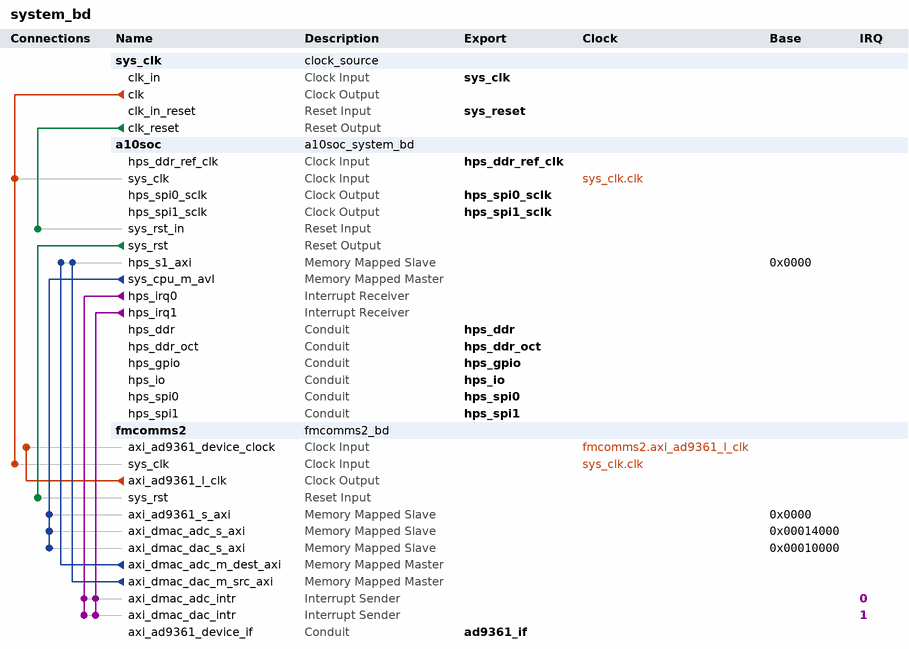
[diagram p0: system contents]
# Platform Designer (Qsys) system system_bd, Arria 10 10AS066N3F40E2SGE2
# Parameters at their usual value, and those the tool derives, are not listed.
package require -exact qsys 15.1
create_system system_bd
set_project_property DEVICE_FAMILY {Arria 10}
set_project_property DEVICE 10AS066N3F40E2SGE2

add_instance sys_clk clock_source 15.1
set_instance_parameter_value sys_clk clockFrequency 100000000

add_instance a10soc a10soc_system_bd 1.0

add_instance fmcomms2 fmcomms2_bd 1.0

# connections
add_connection fmcomms2.axi_ad9361_l_clk fmcomms2.axi_ad9361_device_clock clock
add_connection sys_clk.clk a10soc.sys_clk clock
add_connection sys_clk.clk fmcomms2.sys_clk clock
add_connection a10soc.sys_rst fmcomms2.sys_rst reset
add_connection sys_clk.clk_reset a10soc.sys_rst_in reset
add_connection a10soc.sys_cpu_m_avl fmcomms2.axi_ad9361_s_axi avalon
set_connection_parameter_value a10soc.sys_cpu_m_avl/fmcomms2.axi_ad9361_s_axi baseAddress 0x0000
add_connection a10soc.sys_cpu_m_avl fmcomms2.axi_dmac_adc_s_axi avalon
set_connection_parameter_value a10soc.sys_cpu_m_avl/fmcomms2.axi_dmac_adc_s_axi baseAddress 0x00014000
add_connection a10soc.sys_cpu_m_avl fmcomms2.axi_dmac_dac_s_axi avalon
set_connection_parameter_value a10soc.sys_cpu_m_avl/fmcomms2.axi_dmac_dac_s_axi baseAddress 0x00010000
add_connection fmcomms2.axi_dmac_adc_m_dest_axi a10soc.hps_s1_axi avalon
set_connection_parameter_value fmcomms2.axi_dmac_adc_m_dest_axi/a10soc.hps_s1_axi baseAddress 0x0000
add_connection fmcomms2.axi_dmac_dac_m_src_axi a10soc.hps_s1_axi avalon
set_connection_parameter_value fmcomms2.axi_dmac_dac_m_src_axi/a10soc.hps_s1_axi baseAddress 0x0000
add_connection a10soc.hps_irq0 fmcomms2.axi_dmac_adc_intr interrupt
set_connection_parameter_value a10soc.hps_irq0/fmcomms2.axi_dmac_adc_intr irqNumber 0
add_connection a10soc.hps_irq0 fmcomms2.axi_dmac_dac_intr interrupt
set_connection_parameter_value a10soc.hps_irq0/fmcomms2.axi_dmac_dac_intr irqNumber 1
add_connection a10soc.hps_irq1 fmcomms2.axi_dmac_adc_intr interrupt
set_connection_parameter_value a10soc.hps_irq1/fmcomms2.axi_dmac_adc_intr irqNumber 0
add_connection a10soc.hps_irq1 fmcomms2.axi_dmac_dac_intr interrupt
set_connection_parameter_value a10soc.hps_irq1/fmcomms2.axi_dmac_dac_intr irqNumber 1

# exported interfaces
add_interface ad9361_if conduit end
set_interface_property ad9361_if EXPORT_OF fmcomms2.axi_ad9361_device_if
add_interface hps_ddr conduit end
set_interface_property hps_ddr EXPORT_OF a10soc.hps_ddr
add_interface hps_ddr_oct conduit end
set_interface_property hps_ddr_oct EXPORT_OF a10soc.hps_ddr_oct
add_interface hps_ddr_ref_clk clock sink
set_interface_property hps_ddr_ref_clk EXPORT_OF a10soc.hps_ddr_ref_clk
add_interface hps_gpio conduit end
set_interface_property hps_gpio EXPORT_OF a10soc.hps_gpio
add_interface hps_io conduit end
set_interface_property hps_io EXPORT_OF a10soc.hps_io
add_interface hps_spi0 conduit end
set_interface_property hps_spi0 EXPORT_OF a10soc.hps_spi0
add_interface hps_spi0_sclk clock source
set_interface_property hps_spi0_sclk EXPORT_OF a10soc.hps_spi0_sclk
add_interface hps_spi1 conduit end
set_interface_property hps_spi1 EXPORT_OF a10soc.hps_spi1
add_interface hps_spi1_sclk clock source
set_interface_property hps_spi1_sclk EXPORT_OF a10soc.hps_spi1_sclk
add_interface sys_clk clock sink
set_interface_property sys_clk EXPORT_OF sys_clk.clk_in
add_interface sys_reset reset sink
set_interface_property sys_reset EXPORT_OF sys_clk.clk_in_reset

set_interconnect_requirement {$system} qsys_mm.clockCrossingAdapter FIFO
set_interconnect_requirement {$system} qsys_mm.insertDefaultSlave false
set_interconnect_requirement {$system} qsys_mm.maxAdditionalLatency 2

save_system system_bd.qsys
